# EAGLE board Cubesat_Potencia_Controle-rev3 (EAGLE 7.2.0), part 1 of 2
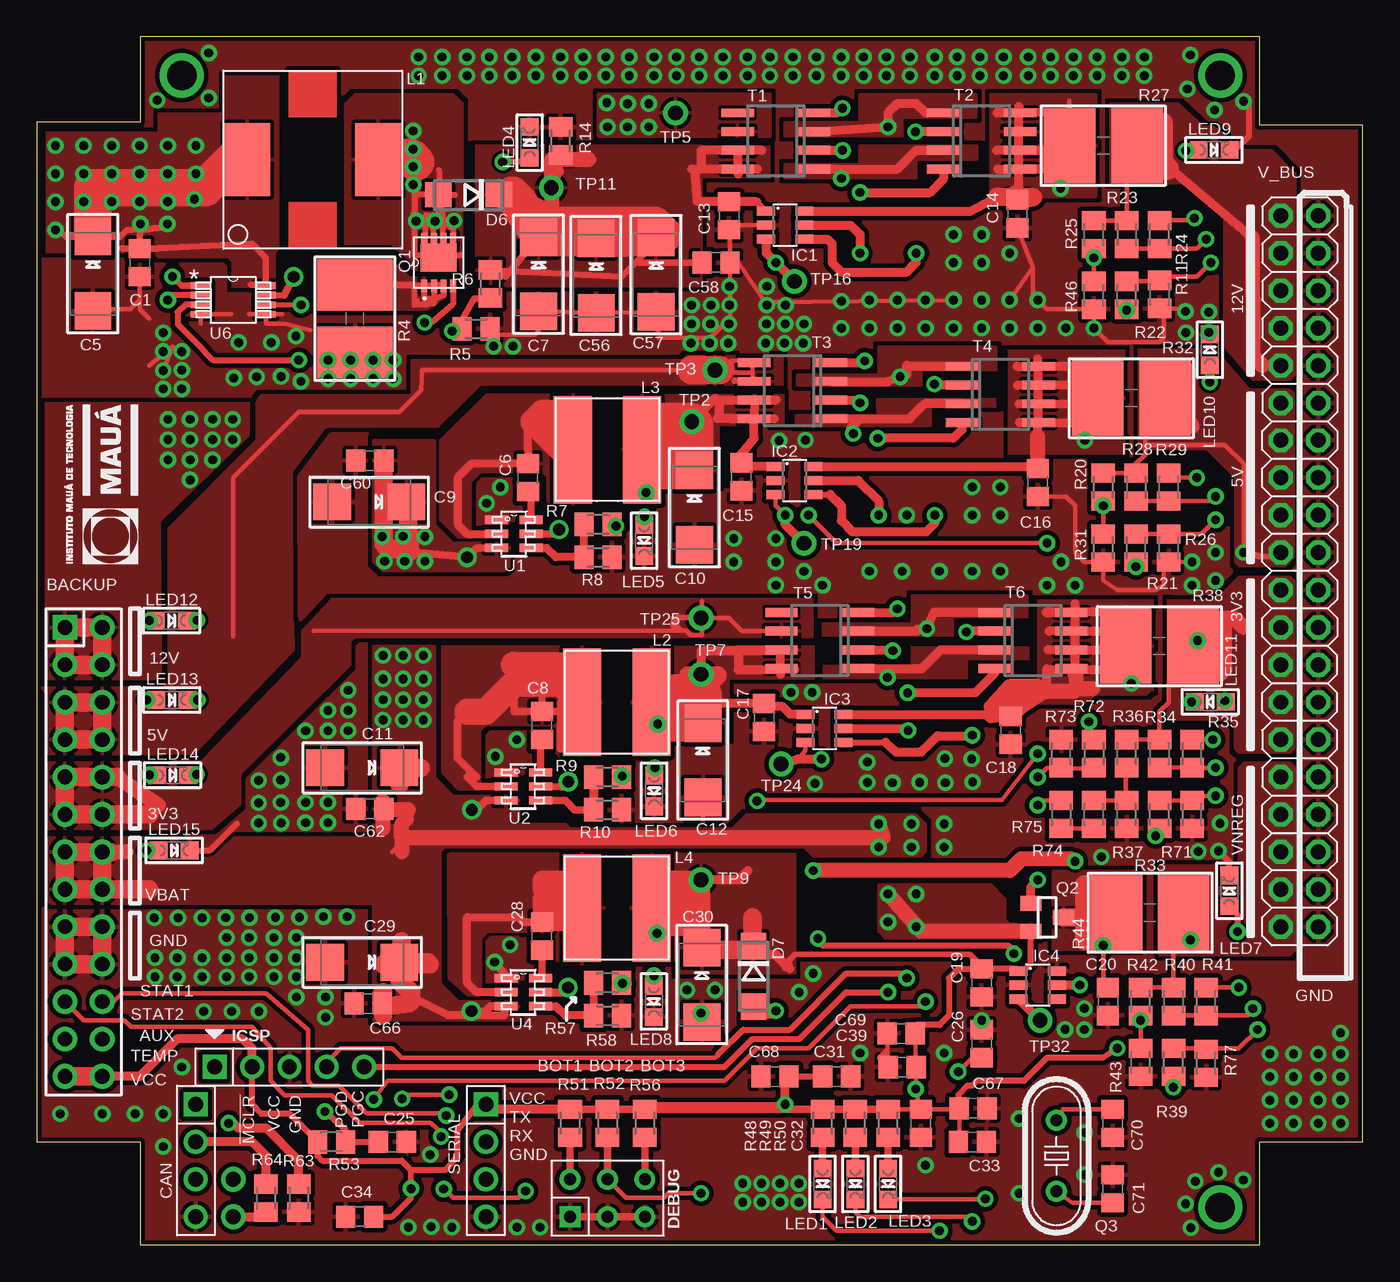
[diagram p7: board, top side]
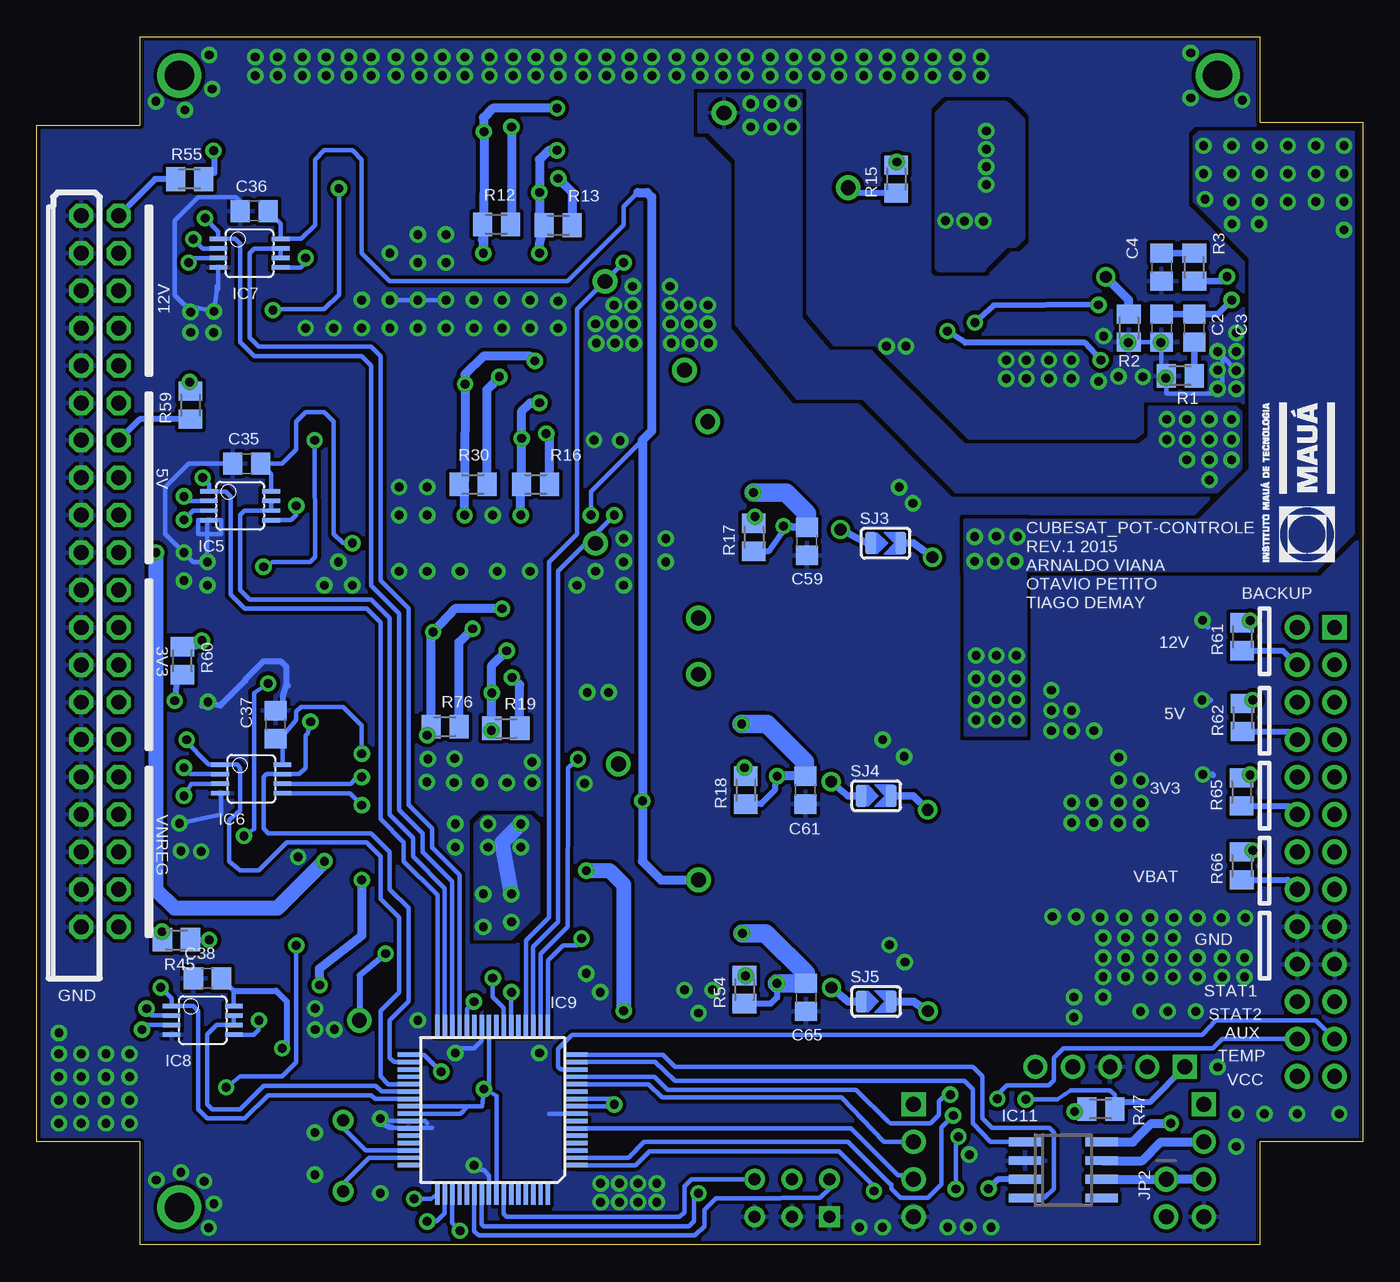
[diagram p8: board, bottom side, seen from below]

Size 90 x 82 mm. Coordinates in mm from the lower left corner, seen from the top.
Outline: 7,0 83,0 83,7 90,7 90,76 83,76 83,82 7,82 7,76.2 0,76.2 0,7 7,7 7,0
Copper layers (1*16): Top 0.035mm / dielectric 1.5mm / Bottom 0.035mm
Design rules "default": minimum track width 8mil, minimum drill 20mil, track to track 8mil, track to pad 8mil, pad to pad 8mil, via to via 8mil, smd to smd 8mil, copper to edge 10mil, drill to drill 8mil, minimum pad ring 12mil, minimum via ring 10mil, stop-mask expansion 4mil, vias tented up to drill 25mil, thermal gap 10mil

## Footprints (pad centres in the part's own frame; a part is rotated, then mirrored left to right if it is on the bottom)
2X13 = drill 1 pad 1.676 square: 1 -15.24,-1.27 | drill 1 pad 1.676: 2 -15.24,1.27; 3 -12.7,-1.27; 4 -12.7,1.27; 5 -10.16,-1.27; 6 -10.16,1.27; 7 -7.62,-1.27; 8 -7.62,1.27; 9 -5.08,-1.27; 10 -5.08,1.27; 11 -2.54,-1.27; 12 -2.54,1.27; 13 0,-1.27; 14 0,1.27; 15 2.54,-1.27; 16 2.54,1.27; 17 5.08,-1.27; 18 5.08,1.27; 19 7.62,-1.27; 20 7.62,1.27; 21 10.16,-1.27; 22 10.16,1.27; 23 12.7,-1.27; 24 12.7,1.27; 25 15.24,-1.27; 26 15.24,1.27
C0805 = smd 1.3 x 1.5: 1 -0.95,0; 2 0.95,0
EIA6032-28/C-R = smd 2.55 x 2.5: + 2.525,0; - -2.525,0
M1X4 = drill 1.02 pad 1.632 square: 1 0,0 | drill 1.02 pad 1.632: 2 2.54,0; 3 5.08,0; 4 7.62,0
DO214AC = smd 1.8 x 1.7: A 2.05,0; C -2.05,0
M2X3 = drill 0.8 square: 1 -2.54,-1.27 | drill 0.8: 2 -2.54,1.27; 3 0,-1.27; 4 0,1.27; 5 2.54,-1.27; 6 2.54,1.27
TSOT23-6 = smd 0.62 x 1.22: 1 -0.95,-1.3; 2 0,-1.3; 3 0.95,-1.3; 4 0.95,1.3; 5 0,1.3; 6 -0.95,1.3
MSOP08 = smd 0.3 x 1.2: 1 -0.976,-2.113; 2 -0.326,-2.113; 3 0.324,-2.113; 4 0.974,-2.113; 5 0.974,2.112; 6 0.324,2.112; 7 -0.326,2.112; 8 -0.976,2.112
TQFP64-10X10X1MM = smd 1.5 x 0.3: 1 -5.7,3.75; 2 -5.7,3.25; 3 -5.7,2.75; 4 -5.7,2.25; 5 -5.7,1.75; 6 -5.7,1.25; 7 -5.7,0.75; 8 -5.7,0.25; 9 -5.7,-0.25; 10 -5.7,-0.75; 11 -5.7,-1.25; 12 -5.7,-1.75; 13 -5.7,-2.25; 14 -5.7,-2.75; 15 -5.7,-3.25; 16 -5.7,-3.75; 33 5.7,-3.75; 34 5.7,-3.25; 35 5.7,-2.75; 36 5.7,-2.25; 37 5.7,-1.75; 38 5.7,-1.25; 39 5.7,-0.75; 40 5.7,-0.25; 41 5.7,0.25; 42 5.7,0.75; 43 5.7,1.25; 44 5.7,1.75; 45 5.7,2.25; 46 5.7,2.75; 47 5.7,3.25; 48 5.7,3.75 | smd 0.3 x 1.5: 17 -3.75,-5.7; 18 -3.25,-5.7; 19 -2.75,-5.7; 20 -2.25,-5.7; 21 -1.75,-5.7; 22 -1.25,-5.7; 23 -0.75,-5.7; 24 -0.25,-5.7; 25 0.25,-5.7; 26 0.75,-5.7; 27 1.25,-5.7; 28 1.75,-5.7; 29 2.25,-5.7; 30 2.75,-5.7; 31 3.25,-5.7; 32 3.75,-5.7; 49 3.75,5.7; 50 3.25,5.7; 51 2.75,5.7; 52 2.25,5.7; 53 1.75,5.7; 54 1.25,5.7; 55 0.75,5.7; 56 0.25,5.7; 57 -0.25,5.7; 58 -0.75,5.7; 59 -1.25,5.7; 60 -1.75,5.7; 61 -2.25,5.7; 62 -2.75,5.7; 63 -3.25,5.7; 64 -3.75,5.7
SO-08 = smd 0.6 x 2.2: 1 -1.905,-2.6; 2 -0.635,-2.6; 3 0.635,-2.6; 4 1.905,-2.6; 5 1.905,2.6; 6 0.635,2.6; 7 -0.635,2.6; 8 -1.905,2.6
HEADER_PRG_1X05_ICSP_B = drill 1.016 square: 1 -5.08,0 | drill 1.016: 2 -2.54,0; 3 0,0; 4 2.54,0; 5 5.08,0
1X02_ROUND = drill 1 pad 1.676: 1 -1.27,0; 2 1.27,0
SDR1307 = smd 4.95 x 3.135: 1 0,4.445; 2 0,-4.445
SRR6038 = smd 2.591 x 7.29: 1 -2.349,0; 2 2.349,0
CHIPLED_0805 = smd 1.2 x 1.2: A 0,-1.05; C 0,1.05
TRANS_NEXFET_Q3 = smd 0.864 x 0.406: 1 -1.575,0.975; 2 -1.575,0.325; 3 -1.575,-0.325; 4 -1.575,-0.975; 5 1.575,-0.975; 6 1.575,-0.325; 7 1.575,0.325; 8 1.575,0.975 | smd 1.905 x 2.438: 9 0.342,0
SUPER-SOT3 = smd 1 x 1.4: 1 -0.95,-1.1; 2 0.95,-1.1; 3 0,1.1
HC49/S = drill 0.813: 1 -2.413,0; 2 2.413,0
M0805 = smd 1.3 x 1.6: 1 -0.95,0; 2 0.95,0
_2818 = smd 3.5 x 5.1: 1 -2.286,0; 2 2.286,0
SOLDERJUMPER_ARROW_NOPASTE = smd 0.762 x 1.524: 1 -1.016,0; 2 1.016,0
SO8 = smd 0.6 x 2.2: 1 -1.905,-2.6; 2 -0.635,-2.6; 3 0.635,-2.6; 4 1.905,-2.6; 5 1.905,2.6; 6 0.635,2.6; 7 -0.635,2.6; 8 -1.905,2.6
1X01_ROUND = drill 1 pad 1.676: 1 0,0
DDC0006A = smd 1.575 x 0.559: 1 -1.168,0.95; 2 -1.168,0; 3 -1.168,-0.95; 4 1.168,-0.95; 5 1.168,0; 6 1.168,0.95
MUA08A = smd 1.372 x 0.457: 1 -2.197,0.975; 2 -2.197,0.325; 3 -2.197,-0.325; 4 -2.197,-0.975; 5 2.197,-0.975; 6 2.197,-0.325; 7 2.197,0.325; 8 2.197,0.975
2X20 = drill 1.016 octagon: 1 -24.13,-1.27; 2 -24.13,1.27; 3 -21.59,-1.27; 4 -21.59,1.27; 5 -19.05,-1.27; 6 -19.05,1.27; 7 -16.51,-1.27; 8 -16.51,1.27; 9 -13.97,-1.27; 10 -13.97,1.27; 11 -11.43,-1.27; 12 -11.43,1.27; 13 -8.89,-1.27; 14 -8.89,1.27; 15 -6.35,-1.27; 16 -6.35,1.27; 17 -3.81,-1.27; 18 -3.81,1.27; 19 -1.27,-1.27; 20 -1.27,1.27; 21 1.27,-1.27; 22 1.27,1.27; 23 3.81,-1.27; 24 3.81,1.27; 25 6.35,-1.27; 26 6.35,1.27; 27 8.89,-1.27; 28 8.89,1.27; 29 11.43,-1.27; 30 11.43,1.27; 31 13.97,-1.27; 32 13.97,1.27; 33 16.51,-1.27; 34 16.51,1.27; 35 19.05,-1.27; 36 19.05,1.27; 37 21.59,-1.27; 38 21.59,1.27; 39 24.13,-1.27; 40 24.13,1.27

## Placement (x,y rotation side)
BACKUP  [2X13]  3.17,26.67 270 top
C1  100nF  [C0805]  6.98,66.67 270 top
C2  2.2nF  [C0805]  13.65,62.23 270 bottom
C3  47nF  [C0805]  11.43,62.23 270 bottom
C4  10nF  [C0805]  13.65,66.36 270 bottom
C5  47uF  [EIA6032-28/C-R]  3.81,65.91 90 top
C6  100nF  [C0805]  33.34,52.07 90 top
C7  47uF  [EIA6032-28/C-R]  34.06,65.87 90 top
C8  100nF  [C0805]  34.29,35.24 90 top
C9  22uF  [EIA6032-28/C-R]  22.57,50.43 0 top
C10  47uF  [EIA6032-28/C-R]  44.64,50.04 90 top
C11  22uF  [EIA6032-28/C-R]  22.1,32.38 0 top
C12  47uF  [EIA6032-28/C-R]  45.21,32.89 90 top
C13  100nF  [C0805]  46.99,69.85 90 top
C14  100nF  [C0805]  66.56,69.98 90 top
C15  100nF  [C0805]  47.83,52.13 90 top
C16  100nF  [C0805]  67.95,51.75 90 top
C17  100nF  [C0805]  49.36,35.79 90 top
C18  100nF  [C0805]  66.1,34.92 90 top
C19  100nF  [C0805]  64.14,17.78 90 top
C20  100nF  [C0805]  72.71,16.51 90 top
C25  100nF  [C0805]  24.13,6.99 180 top
C26  10uF  [C0805]  64.14,13.65 270 top
C28  100nF  [C0805]  34.29,20.96 90 top
C29  22uF  [EIA6032-28/C-R]  22.1,19.18 0 top
C30  47uF  [EIA6032-28/C-R]  45.15,17.65 90 top
C31  100nF  [C0805]  54.29,11.43 0 top
C32  100nF  [C0805]  60.01,8.26 270 top
C33  100nF  [C0805]  63.5,6.99 180 top
C34  100nF  [C0805]  21.91,1.9 0 top
C35  100nF  [C0805]  75.76,53.02 0 bottom
C36  100nF  [C0805]  75.25,70.17 0 bottom
C37  100nF  [C0805]  73.79,35.31 270 bottom
C38  100nF  [C0805]  78.42,18.1 0 bottom
C39  100nF  [C0805]  58.74,12.07 180 top
C56  47uF  [EIA6032-28/C-R]  37.97,65.79 90 top
C57  47uF  [EIA6032-28/C-R]  42.04,65.85 90 top
C58  100nF  [C0805]  46.1,66.67 0 top
C59  100nF  [C0805]  37.73,47.75 90 bottom
C60  100nF  [C0805]  22.61,53.23 0 top
C61  100nF  [C0805]  37.83,30.86 90 bottom
C62  100nF  [C0805]  22.61,29.59 0 top
C65  100nF  [C0805]  37.78,16.79 270 bottom
C66  100nF  [C0805]  22.48,16.38 180 top
C67  10uF  [C0805]  63.56,9.27 0 top
C68  10uF  [C0805]  50.1,11.43 180 top
C69  10uF  [C0805]  58.67,14.35 180 top
C70  27pF  [C0805]  73.03,8.26 90 top
C71  27pF  [C0805]  73.03,3.81 270 top
CAN  CON_HEADER_1X04  [M1X4]  10.79,9.53 270 top
D6  B340A-13-F  [DO214AC]  29.31,71.27 180 top
D7  B340A-13-F  [DO214AC]  48.64,18.22 270 top
DEBUG  CON_HEADER_2X03-PTH  [M2X3]  38.73,3.18 0 top
IC1  LTC4412HV  [TSOT23-6]  50.8,69.22 270 top
IC2  LTC4412HV  [TSOT23-6]  51.43,51.88 270 top
IC3  LTC4412HV  [TSOT23-6]  53.47,35.05 270 top
IC4  LTC4412HV  [TSOT23-6]  67.95,17.63 270 top
IC5  LMP2012  [MSOP08]  76.2,50.16 270 bottom
IC6  LMP2012  [MSOP08]  75.44,31.62 270 bottom
IC7  LMP2012  [MSOP08]  75.57,67.31 270 bottom
IC8  LMP2012  [MSOP08]  78.74,15.24 270 bottom
IC9  PIC18F66K80  [TQFP64-10X10X1MM]  59.05,9.15 180 bottom
IC11  MCP2551  [SO-08]  20.32,5.08 270 bottom
ICSP  CON_HEADER_PRG_PIC_ICSP0.1INCH_B  [HEADER_PRG_1X05_ICSP_B]  17.15,12.07 0 top
JP2  [1X02_ROUND]  13.33,3.18 270 bottom
L1  33uH  [SDR1307]  18.73,73.66 90 top
L2  2.2uH  [SRR6038]  39.37,36.83 0 top
L3  3.3uH  [SRR6038]  38.73,53.97 0 top
L4  3.3uH  [SRR6038]  39.37,22.86 0 top
LED1  GREEN  [CHIPLED_0805]  53.34,4.13 180 top
LED2  GREEN  [CHIPLED_0805]  55.56,4.13 180 top
LED3  GREEN  [CHIPLED_0805]  57.78,4.13 180 top
LED4  GREEN  [CHIPLED_0805]  33.45,74.83 0 top
LED5  GREEN  [CHIPLED_0805]  41.22,47.8 180 top
LED6  GREEN  [CHIPLED_0805]  41.91,30.81 180 top
LED7  GREEN  [CHIPLED_0805]  80.95,24.03 0 top
LED8  GREEN  [CHIPLED_0805]  41.88,16.51 180 top
LED9  GREEN  [CHIPLED_0805]  79.91,74.32 270 top
LED10  GREEN  [CHIPLED_0805]  79.63,60.76 0 top
LED11  GREEN  [CHIPLED_0805]  79.65,36.86 90 top
LED12  GREEN  [CHIPLED_0805]  9.14,42.37 270 top
LED13  GREEN  [CHIPLED_0805]  9.17,36.98 270 top
LED14  GREEN  [CHIPLED_0805]  9.22,31.88 270 top
LED15  GREEN  [CHIPLED_0805]  9.32,26.77 270 top
Q1  CSD16323Q3  [TRANS_NEXFET_Q3]  27.28,66.67 90 top
Q2  FDN360P  [SUPER-SOT3]  68.58,22.23 270 top
Q3  4MHz  [HC49/S]  69.22,6.03 270 top
R1  3.4k  [M0805]  12.38,58.98 0 bottom
R2  71.5k  [M0805]  15.88,62.23 90 bottom
R3  100  [M0805]  11.43,66.36 270 bottom
R4  0.033R  [_2818]  21.59,62.87 90 top
R5  1k  [M0805]  29.82,62.18 180 top
R6  8.45k  [M0805]  30.8,65.23 270 top
R7  56.2k  [M0805]  38.1,48.89 0 top
R8  10k  [M0805]  38.1,46.67 180 top
R9  33.2k  [M0805]  38.73,31.75 0 top
R10  10k  [M0805]  38.73,29.53 180 top
R11  220k  [M0805]  76.2,64.52 90 top
R12  680k  [M0805]  58.8,69.28 180 bottom
R13  680k  [M0805]  54.61,69.22 180 bottom
R14  3k3  [M0805]  35.56,74.93 270 top
R15  470R  [M0805]  31.67,72.34 90 bottom
R16  680k  [M0805]  56.13,51.63 180 bottom
R17  470R  [M0805]  41.33,48.03 90 bottom
R18  470R  [M0805]  41.88,30.86 90 bottom
R19  680k  [M0805]  58.17,35.05 180 bottom
R20  1k5  [M0805]  72.39,51.43 270 top
R21  22k  [M0805]  74.61,47.31 270 top
R22  22k  [M0805]  73.98,64.45 270 top
R23  22k  [M0805]  73.98,68.58 90 top
R24  220k  [M0805]  76.2,68.58 270 top
R25  33.2k  [M0805]  71.76,68.58 270 top
R26  220k  [M0805]  76.84,47.31 270 top
R27  0.1R  [_2818]  72.39,74.61 0 top
R28  22k  [M0805]  74.61,51.43 90 top
R29  220k  [M0805]  76.84,51.43 270 top
R30  680k  [M0805]  60.39,51.63 180 bottom
R31  10k  [M0805]  72.39,47.31 270 top
R32  0.1R  [_2818]  74.3,57.47 0 top
R33  22k  [M0805]  76.2,29.21 270 top
R34  22k  [M0805]  76.2,33.34 90 top
R35  220k  [M0805]  78.42,33.34 270 top
R36  10k  [M0805]  73.98,33.34 270 top
R37  10k  [M0805]  73.98,29.21 270 top
R38  0.1R  [_2818]  76.2,40.64 0 top
R39  22k  [M0805]  77.15,12.38 270 top
R40  22k  [M0805]  77.15,16.51 90 top
R41  220k  [M0805]  79.38,16.51 270 top
R42  10k  [M0805]  74.93,16.51 270 top
R43  10k  [M0805]  74.93,12.38 270 top
R44  0.1R  [_2818]  75.57,22.54 0 top
R45  470R  [M0805]  80.52,20.7 180 bottom
R46  22k  [M0805]  71.76,64.45 270 top
R47  470R  [M0805]  17.78,9.21 0 bottom
R48  470R  [M0805]  53.34,8.26 270 top
R49  470R  [M0805]  55.56,8.26 270 top
R50  470R  [M0805]  57.78,8.26 270 top
R51  10k  [M0805]  36.2,8.26 90 top
R52  10k  [M0805]  38.73,8.26 90 top
R53  10k  [M0805]  20,6.99 0 top
R54  470R  [M0805]  41.96,17.32 90 bottom
R55  470R  [M0805]  79.63,72.34 0 bottom
R56  10k  [M0805]  41.27,8.26 90 top
R57  56.2k  [M0805]  38.73,17.78 0 top
R58  10k  [M0805]  38.73,15.56 180 top
R59  470R  [M0805]  79.58,57 90 bottom
R60  470R  [M0805]  80.11,39.65 270 bottom
R61  470R  [M0805]  8.18,41.27 90 bottom
R62  470R  [M0805]  8.15,35.79 90 bottom
R63  [M0805]  17.78,3.18 90 top
R64  120R  [M0805]  15.56,3.18 90 top
R65  470R  [M0805]  8.23,30.73 90 bottom
R66  470R  [M0805]  8.2,25.73 90 bottom
R71  220k  [M0805]  78.42,29.21 270 top
R72  17.4k  [M0805]  71.76,33.34 90 top
R73  10k  [M0805]  69.53,33.34 270 top
R74  3.4k  [M0805]  71.76,29.21 270 top
R75  3.4k  [M0805]  69.53,29.21 90 top
R76  680k  [M0805]  62.29,35.18 180 bottom
R77  220k  [M0805]  79.38,12.32 270 top
SERIAL  CON_HEADER_1X04  [M1X4]  30.48,9.53 270 top
SJ3  [SOLDERJUMPER_ARROW_NOPASTE]  32.38,47.62 0 bottom
SJ4  [SOLDERJUMPER_ARROW_NOPASTE]  33.02,30.48 0 bottom
SJ5  [SOLDERJUMPER_ARROW_NOPASTE]  33.02,16.51 0 bottom
T1  Si9933CDY  [SO8]  50.16,74.93 90 top
T2  Si9933CDY  [SO8]  64.14,74.93 270 top
T3  Si9933CDY  [SO8]  51.31,57.98 90 top
T4  Si9933CDY  [SO8]  65.41,57.72 270 top
T5  Si9933CDY  [SO8]  53.15,41.02 90 top
T6  Si9933CDY  [SO8]  67.63,41.02 270 top
TP2  [1X01_ROUND]  44.45,55.88 0 top
TP3  [1X01_ROUND]  46.04,59.37 0 top
TP5  [1X01_ROUND]  43.36,76.84 270 top
TP7  [1X01_ROUND]  45.09,38.73 0 top
TP9  [1X01_ROUND]  45.09,24.77 0 top
TP11  [1X01_ROUND]  34.92,71.76 0 top
TP16  [1X01_ROUND]  51.43,65.41 0 top
TP19  [1X01_ROUND]  52.07,47.62 0 top
TP24  [1X01_ROUND]  50.52,32.64 90 top
TP25  [1X01_ROUND]  45.09,42.54 90 top
TP32  [1X01_ROUND]  68.1,15.24 0 top
U1  TPS563200DDCR  [DDC0006A]  32.38,48.26 0 top
U2  TPS563200DDCR  [DDC0006A]  33.02,31.11 0 top
U4  TPS563200DDCR  [DDC0006A]  33.02,17.14 0 top
U6  LM3488MM/NOPB  [MUA08A]  13.33,64.14 0 top
U$112  [LOGO_MAUA]  6.87,46.23 90 top
U$113  [LOGO_MAUA]  1.91,46.35 90 bottom
V_BUS  V_BUS  [2X20]  85.73,45.72 270 top